# EAGLE design cominer_serial (EAGLE 9.6.2)
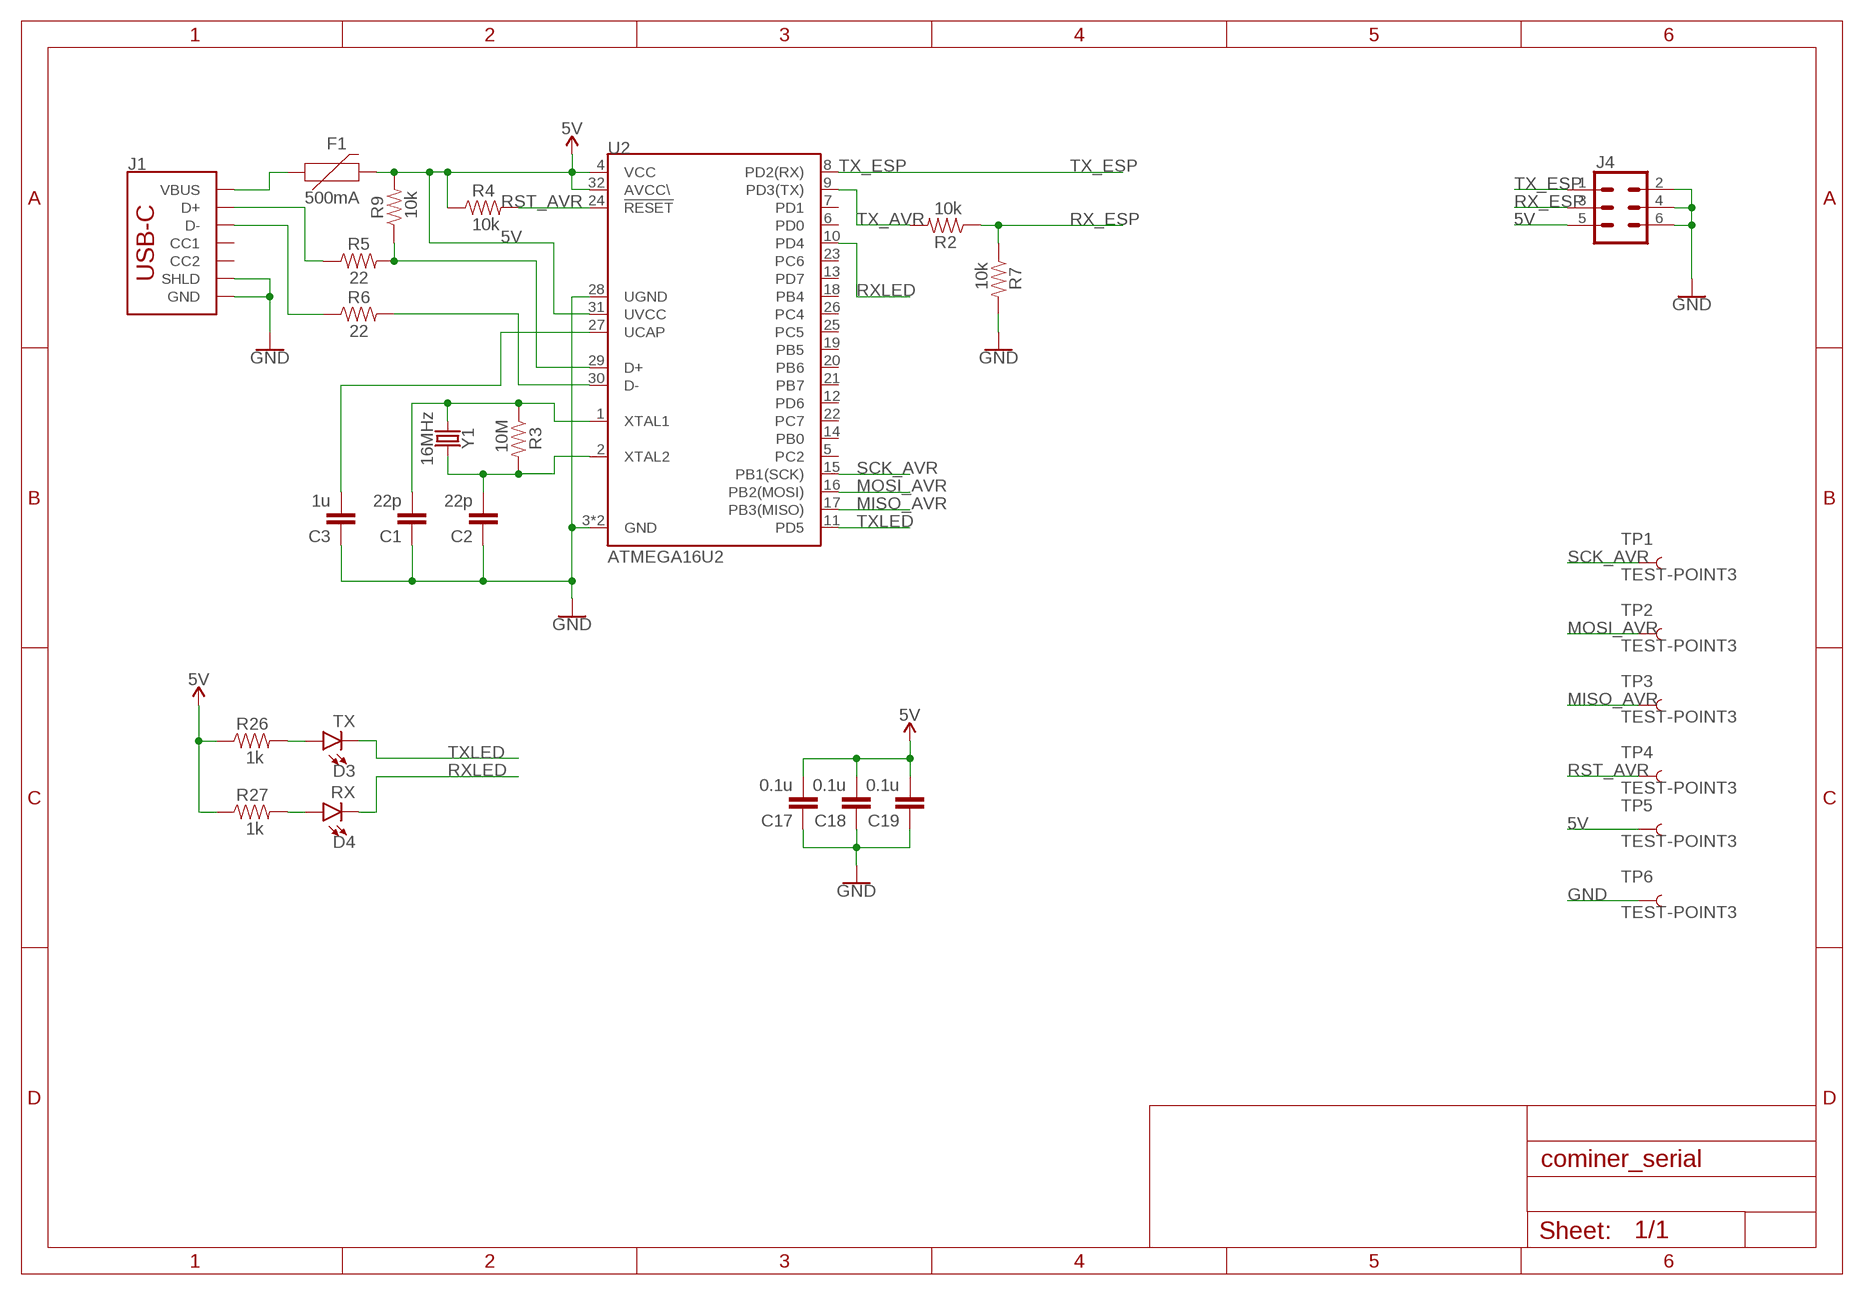
[diagram p0: schematic, sheet 1]

## Parts
C1  22p  CAP-0805  [0805]
C2  22p  CAP-0805  [0805]
C3  1u  CAP-0805  [0805]
C17  0.1u  CAP-0805  [0805]
C18  0.1u  CAP-0805  [0805]
C19  0.1u  CAP-0805  [0805]
D3  TX  LED-YELLOW0603  [LED-0603]
D4  RX  LED-YELLOW0603  [LED-0603]
F1  500mA  PPTC_16V_2.5A  [1812]
J1  USB_C  [USB-C-16P-SMD]
J4  CONN_03X2SHROUD  [2X3-SHROUDED]
R2  10k  RESISTOR0805  [0805]
R3  10M  RESISTOR0805  [0805]
R4  10k  RESISTOR0805  [0805]
R5  22  RESISTOR0805  [0805]
R6  22  RESISTOR0805  [0805]
R7  10k  RESISTOR0805  [0805]
R9  10k  RESISTOR0805  [0805]
R26  1k  RESISTOR0805  [0805]
R27  1k  RESISTOR0805  [0805]
TP1  TEST-POINT3  [PAD.03X.03]
TP2  TEST-POINT3  [PAD.03X.03]
TP3  TEST-POINT3  [PAD.03X.03]
TP4  TEST-POINT3  [PAD.03X.03]
TP5  TEST-POINT3  [PAD.03X.03]
TP6  TEST-POINT3  [PAD.03X.03]
U2  ATMEGA16U2  [QFN32]
Y1  16MHz  CRYSTAL-16MHZSMD-5X3.2  [CRYSTAL-SMD-5X3.2-4PAD]

## Nets
5V: C17.2 C18.2 C19.2 F1.2 J4.5 R4.1 R9.2 R26.1 R27.1 TP5.P$1 U2.4(VCC) U2.31(UVCC) U2.32(AVCC\)
GND: C1.1 C2.1 C3.1 C17.1 C18.1 C19.1 J1.GND J1.GND2(GND) J1.SHLD1(SHLD) J1.SHLD2(SHLD) J1.SHLD3(SHLD) J1.SHLD4(SHLD) J4.2 J4.4 J4.6 R7.2 TP6.P$1 U2.3(GND) U2.28(UGND) U2.EP(GND)
MISO_AVR: TP3.P$1 U2.17(PB3(MISO))
MOSI_AVR: TP2.P$1 U2.16(PB2(MOSI))
N$1: C1.2 R3.1 U2.1(XTAL1) Y1.1
N$2: C2.2 R3.2 U2.2(XTAL2) Y1.3
N$3: C3.2 U2.27(UCAP)
N$6: R6.2 U2.30(D-)
N$7: R5.2 R9.1 U2.29(D+)
N$8: J1.A6(D+) J1.B6(D+) R5.1
N$9: J1.A7(D-) J1.B7(D-) R6.1
N$10: F1.1 J1.VBUS1(VBUS) J1.VBUS2(VBUS)
N$32: D3.A R26.2
N$33: D4.A R27.2
RST_AVR: R4.2 TP4.P$1 U2.24(!RESET)
RX_ESP: J4.3 R2.1 R7.1
RXLED: D4.C U2.10(PD4)
SCK_AVR: TP1.P$1 U2.15(PB1(SCK))
TX_AVR: R2.2 U2.9(PD3(TX))
TX_ESP: J4.1 U2.8(PD2(RX))
TXLED: D3.C U2.11(PD5)
Unconnected: J1.A5(CC1) J1.B5(CC2) U2.5(PC2) U2.6(PD0) U2.7(PD1) U2.12(PD6) U2.13(PD7) U2.14(PB0) U2.18(PB4) U2.19(PB5) U2.20(PB6) U2.21(PB7) U2.22(PC7) U2.23(PC6) U2.25(PC5) U2.26(PC4)

## Library data of the parts
C1-C3 C17-C19 = SparkFun-Capacitors:CAP
D3 D4 = SparkFun-LED:LED-YELLOW: Yellow SMD LED Used in manufacturing several products at SparkFun. Packages: 0603 - SMD 0603 package[Product Link] <http://www.kingbrightusa.com/product.asp?catalog_name=LED&product_id=APT1608SYCK> 0603 -SMART - SMART SMD 0603 package (more efficient/more expensive) [Product Link] <http://www.osram-os.com/osram_os/en/products/product-catalog/led-light-emitting-diodes/smartled-0603/ly-l29k/index.jsp> LilyPad - SMD1206 package[Product Datasheet] <https://www.sparkfun.com/datasheets/DevTools/LilyPad/Q150YUS4.pdf> SparkFun Products: Blynk Board <https://www.sparkfun.com/products/13794> IOIO-OTG <https://www.sparkfun.com/products/13613> XBee Explorer Serial <https://www.sparkfun.com/products/13225>; PROD_ID: DIO-09003; VALUE: Yellow
F1 = SparkFun-Fuses:PPTC: Resettable Fuse PPTC Resettable Fuse. Really a sort of resistor with a polymeric positive temperature coefficient whose resistance increases dramatically with an increase in temperature. When heated by the power passing through the resistance rises causing the current to be limited, protecting the circuit. This is achieved by the transition of the polymer from a crystalline to an amorphous state where the conductive carbon separates breaking the conductive pathways found in the cool crystalline structure. When a PPTC cools back down it resumes conducting letting the circuit turn back on. SparkFun Products: SparkFun RedBoard - Programmed with Arduino <https://www.sparkfun.com/products/12757> Pro Micro - 5V/16MHz <https://www.sparkfun.com/products/12640> Arduino Pro 328 - 5V/16MHz <https://www.sparkfun.com/products/10915> MP3 Trigger <https://www.sparkfun.com/products/13720>; PROD_ID: RES-14390; VALUE: 16V/2.5A(5A TRIP)
J1 = SparkFun-Connectors:USB_C: USB Type C 16Pin Connector Super Speed pins not available on the 16-pin purely SMD connector so this part is best for USB 2.0 implementations. D1 and D2 are tied together enabling D+/- no matter which way the cable is plugged into the connector. The two channel configuration pins (CC1/2) are exposed. These are normally connected to ground via 5.1k resistors but can be reconfigured for high current/high power applications. **4-LAYER BOARD WARNING!!** If designing 4-layer board, make sure to select the variant _4-LAYER-ISOLATED. The linked footprint (USB-C-16-4LAYER-ISOLATED) includes some very necessary cutout polygons in the inner layers (2 and 15). This prevents the PTH mounting shield legs on the USB connector from electrically connecting any other polygons on the inner layers (usually VCC and GND).
J4 = SparkFun-Connectors:CONN_03X2: Multi connection point. Often used as Generic Header-pin footprint for 0.1 inch spaced/style header connections You can populate with any combo of single row headers, but if you'd like an exact match, check these: Header - 2x3 (Male, 0.1") <https://www.sparkfun.com/products/12807> (PRT-12807) Header - 2x3 (Female, 0.1") <https://www.sparkfun.com/products/13010> (PRT-13010) 2x3 Pin Shrouded Header <https://www.sparkfun.com/products/10877> (PRT-10877) On any of the 0.1 inch spaced packages, you can populate with these: Break Away Headers - Straight <https://www.sparkfun.com/products/116> (PRT-00116) Break Away Male Headers - Right Angle <https://www.sparkfun.com/products/553> (PRT-00553) Female Headers <https://www.sparkfun.com/products/115> (PRT-00115) Break Away Headers - Machine Pin <https://www.sparkfun.com/products/117> (PRT-00117) Break Away Female Headers - Swiss Machine Pin <https://www.sparkfun.com/products/743> (PRT-00743) Special note: the shrouded connector mates well with our 3x2 ribbon cables: Ribbon Crimp Connector - 6-pin (2x3, Female) <https://www.sparkfun.com/products/10651> (PRT-10651) Ribbon Cable - 6 wire (15ft) <https://www.sparkfun.com/products/10646> (PRT-10646); PROD_ID: CONN-10681; SF_ID: PRT_10877
R2-R7 R9 R26 R27 = SparkFun-Resistors:RESISTOR: Generic Resistor Package
TP1-TP6 = SparkFun-Connectors:TEST-POINT: SparkFun Test Points Bare copper test points for troubleshooting or In-Circuit-Testing. These are used by our Production team for verifying production board runs using pogo-pins on test beds. SparkFun Products: SparkFun LSM9DS1 Breakout <https://www.sparkfun.com/products/13284> SparkFun PSOC <https://www.sparkfun.com/products/13714> SparkFun Load Cell Amplifier <https://www.sparkfun.com/products/13879>
U2 = Cominer-Microcontroller:ATMEGA16U2
Y1 = SparkFun-Clocks:CRYSTAL-16MHZ: 16MHz Crystal Digikey Example <http://www.digikey.com/product-search/en?keywords=535-9122-1-ND> Frequency: 16MHz Frequency Stability: ±50ppm Frequency Tolerance: ±20ppm Load Capacitance: 18pF SparkFun Products: Pro Micro -5V/16MHz <https://www.sparkfun.com/products/12640> SparkFun Serial Enabled LCD Kit <https://www.sparkfun.com/products/10097>; PROD_ID: XTAL-08218; SF_ID: COM-00094

## Board
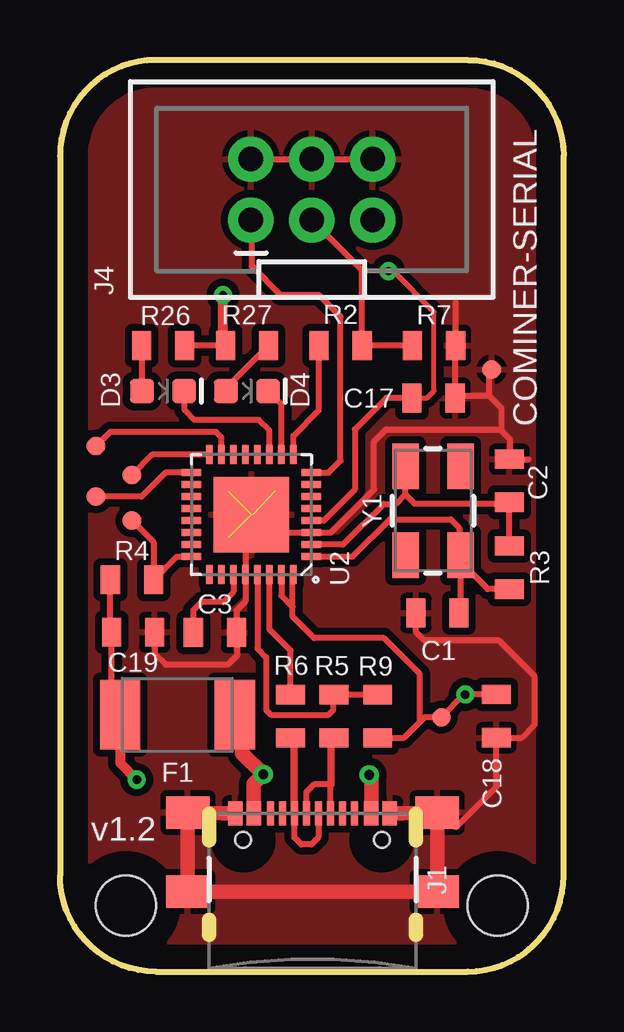
[diagram p1: board, top side]
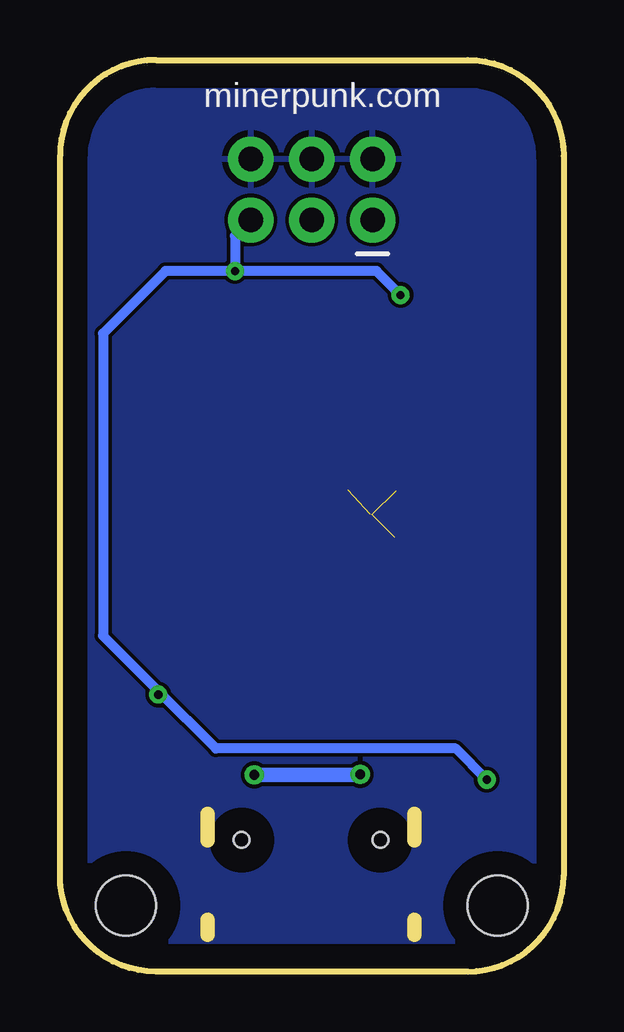
[diagram p2: board, bottom side, seen from below]

Size 21 x 38 mm. Coordinates in mm from the lower left corner, seen from the top.
Outline: 17,38 4,38 arc90 0,34 0,4 arc90 4,0 17,0 arc90 21,4 21,34 arc90 17,38
Copper layers (1*16): Top 0.035mm / dielectric 1.5mm / Bottom 0.035mm
Design rules "default": minimum track width 6mil, minimum drill 0.35mm, track to track 6mil, track to pad 6mil, pad to pad 6mil, via to via 6mil, smd to smd 6mil, copper to edge 40mil, drill to drill 6mil, minimum pad ring 10mil, minimum via ring 8mil, stop-mask expansion 4mil, vias tented up to drill 0mil, thermal gap 10mil
Holes 2.5 mm at 2.75,2.75 18.25,2.75

### Footprints (pad centres in the part's own frame; a part is rotated, then mirrored left to right if it is on the bottom)
0805 = smd 0.8 x 1.2: 1 -0.9,0; 2 0.9,0
LED-0603 = smd 1 x 1: A -0.877,0; C 0.877,0
1812 = smd 1.676 x 2.896: 1 -2.388,0; 2 2.388,0
USB-C-16P-SMD = smd 0.3 x 1: A5 -1.25,-0.34; A6 -0.25,-0.34; A7 0.25,-0.34; A8 1.25,-0.34; B5 1.75,-0.34; B6 0.75,-0.34; B7 -0.75,-0.34; B8 -1.75,-0.34 | smd 0.6 x 1: GND -3.225,-0.34; GND2 3.225,-0.34; VBUS1 -2.45,-0.34; VBUS2 2.45,-0.34 | smd 1.8 x 1.35: SHLD1 -5.2,-0.3; SHLD2 5.2,-0.3; SHLD3 -5.2,-3.6; SHLD4 5.2,-3.6 | hole 0.65: -2.89,-1.445; 2.89,-1.445
2X3-SHROUDED = drill 1.016 pad 1.88: 1 -1.27,2.54; 2 1.27,2.54; 3 -1.27,0; 4 1.27,0; 5 -1.27,-2.54; 6 1.27,-2.54
PAD.03X.03 = smd 0.762 x 0.762: P$1 0,0
QFN32 = smd 0.285 x 0.8: 1 -1.04,-2.5; 2 -0.54,-2.5; 3 -0.04,-2.5; 4 0.46,-2.5; 5 0.96,-2.5; 6 1.46,-2.5; 7 1.96,-2.5; 8 2.46,-2.5; 17 2.46,2.5; 18 1.96,2.5; 19 1.46,2.5; 20 0.96,2.5; 21 0.46,2.5; 22 -0.04,2.5; 23 -0.54,2.5; 24 -1.04,2.5 | smd 0.8 x 0.285: 9 3.21,-1.75; 10 3.21,-1.25; 11 3.21,-0.75; 12 3.21,-0.25; 13 3.21,0.25; 14 3.21,0.75; 15 3.21,1.25; 16 3.21,1.75; 25 -1.79,1.75; 26 -1.79,1.25; 27 -1.79,0.75; 28 -1.79,0.25; 29 -1.79,-0.25; 30 -1.79,-0.75; 31 -1.79,-1.25; 32 -1.79,-1.75 | smd 3.15 x 3.15: EP 0.71,0
CRYSTAL-SMD-5X3.2-4PAD = smd 1.9 x 1.1: 1 -1.85,-1.15; 2 1.85,-1.15; 3 1.85,1.15; 4 -1.85,1.15

### Placement (x,y rotation side)
C1  15.74,14.95 0 top
C2  18.74,20.46 270 top
C3  6.46,14.13 180 top
C17  15.58,23.91 180 top
C18  18.2,10.65 90 top
C19  3.05,14.15 180 top
D3  4.3,24.2 0 top
D4  7.8,24.2 0 top
F1  4.9,10.7 180 top
J1  10.53,6.93 0 top
J4  10.5,32.6 90 top
R2  11.7,26.1 180 top
R3  18.74,16.84 90 top
R4  3,16.33 0 top
R5  11.43,10.64 90 top
R6  9.62,10.64 90 top
R7  15.6,26.1 0 top
R9  13.25,10.64 270 top
R26  4.3,26.1 180 top
R27  7.8,26.1 0 top
TP1  1.5,21.9 180 top
TP2  3,20.7 180 top
TP3  1.5,19.8 180 top
TP4  3,18.8 180 top
TP5  15.9,10.6 180 top
TP6  18,25.1 180 top
U2  7.98,18.34 90 top
Y1  15.56,19.21 90 top

### Tracks (layer width: path | path; a pad name or v marks a point on that pad's centre or on a via)
5V  (via drill 0.35)
  Top 0.203: C17.2 15.31,23.91 15.6,24.2 15.6,27.5 13.9,29.2 v13.7,29.2
  Top 0.254: R9.2 14.34,9.74 15,10.4 | 15,10.4 15,12.4 13.5,13.9 10.6,13.9 9.7,14.8 9.7,15.2 | 9.7,15.2 9.7,16.52 U2.32 | U2.31 9.23,15.67 9.7,15.2 | C17.2 13.61,23.91 12.3,22.6 12.3,20.1 11,18.8 U2.4 | R27.1 R26.1 | C18.2 v16.9,11.55 16.85,11.55 TP5.P$1 15.2,10.6 15,10.4 | F1.2 2.15,11.06 C19.2 2.1,14.2 R4.1
  Top 0.406: F1.2 2.51,8.69 v3.2,8 | R27.1 6.8,26.2 v6.8,28.2
  Bottom 0.406: v3.2,8 4.5,9.3 14.5,9.3 16.9,11.7 | 16.9,11.7 v16.9,11.55 | v6.8,28.2 7.8,29.2 v13.7,29.2 | 16.9,11.7 19.2,14 19.2,26.6 16.6,29.2 v13.7,29.2 | J4.5 13.7,30.67 v13.7,29.2
GND  (3 unrouted)
  Top 0.203: 7,20.03 7,20.1 | 9,20.07 9,20.1 | 7.03,18.1 7,18.1 | U2.EP 8.05,19.05
  Top 0.254: U2.EP 7.73,18.8 U2.28 7.73,15.43 7.36,15.06 C3.1 7.4,14.09 7.4,13.2 7,12.8 4.4,12.8 3.95,13.25 C19.1 | 8.73,18.3 U2.3 11.3,18.3 13.1,20.1 13.1,22.1 13.6,22.6 18.35,22.6 18.4,22.55 | 19.55,21.35 18.75,21.35 C2.1 18.75,21.37 18.75,22.2 18.4,22.55 | C1.1 14.85,14.94 14.85,14.15 15.2,13.8 18.3,13.8 19.8,12.3 19.8,10.3 19.25,9.75 C18.1 18.2,7.7 16.52,6.02 J1.SHLD2 | 17.9,24 18.4,23.5 18.4,22.55 | 17.9,24 17.9,25 TP6.P$1 | 17.9,24 16.57,24 C17.1 16.48,26.08 R7.2 16.5,27.87 | J4.2 J4.4 J4.6
  Top 0.61: J1.GND2 14.27,6.59 J1.SHLD2 J1.SHLD4 J1.SHLD3 J1.SHLD1 6.79,6.59 J1.GND
  pour Top (isolate 0.305): 22,-1 22,39 -1,39 -1,-1
  pour Bottom: -1.9,24.04 -1.9,-1.96 23.1,-1.96 23.1,40.04 -1.9,40.04
MISO_AVR
  Top 0.254: U2.17 4.4,20.8 3.4,19.8 TP3.P$1
MOSI_AVR
  Top 0.254: U2.16 3.85,21.55 TP2.P$1
N$1
  Top 0.254: U2.1 12.2,17.3 13.75,18.85 16.3,18.85 16.65,18.5 16.65,17.42 Y1.1 | C1.2 16.71,15.02 Y1.1 | R3.1 17.84,15.94 16.71,17.07 Y1.1
N$2
  Top 0.254: U2.2 11.8,17.8 13.5,19.5 14,19.5 14.4,19.9 Y1.3 14.41,19.89 14.8,19.5 18.68,19.5 C2.2 R3.2
N$3
  Top 0.254: U2.27 7.23,15.83 6.8,15.4 5.9,15.4 5.56,15.06 C3.2
N$6
  Top 0.254: R6.2 9.62,13.38 8.73,14.27 U2.30
N$7
  Top 0.254: R9.1 R5.2 11.4,11.51 11.4,10.9 11.2,10.7 8.8,10.7 8.6,10.9 8.6,13.1 8.23,13.47 U2.29
N$8
  Top 0.254: 11.5,9.67 R5.1 | J1.B6 11.28,7.8 | 11.28,7.8 11.2,7.8 10.6,7.8 10.28,7.48 J1.A6 | 11.3,7.8 11.28,7.8
  Top 0.305: R5.1 11.3,9.6 11.3,7.8
N$9
  Top 0.254: J1.A7 10.78,5.6 10.48,5.3 10.07,5.3 9.78,5.59 J1.B7
  Top 0.305: R6.1 9.75,9.61 9.75,6.62 J1.B7
N$10  (via drill 0.4)
  Top 0.254: 8.1,6.57 J1.VBUS1
  Top 0.61: 7.29,10.3 F1.1 7.6,10.39 7.6,9.1 v8.48,8.22 8.08,7.82 J1.VBUS1 | J1.VBUS2 12.98,8.12 v12.9,8.2
  Bottom 0.61: v12.9,8.2 8.5,8.2 v8.48,8.22
N$32
  Top 0.254: R26.2 3.4,24.22 D3.A
N$33
  Top 0.254: D4.A 6.92,24.32 R27.2
RST_AVR
  Top 0.254: U2.24 4.87,17.3 R4.2 3.9,17.9 TP4.P$1
RX_ESP
  Top 0.254: R7.1 R2.1 12.6,29.23 J4.3
RXLED
  Top 0.254: U2.10 9.23,23.65 D4.C
SCK_AVR
  Top 0.254: U2.15 6.73,22.27 6.5,22.5 2.1,22.5 TP1.P$1
TX_AVR
  Top 0.254: U2.9 9.73,22.33 10.8,23.4 R2.2
TX_ESP
  Top 0.254: J4.1 8,31.29 8,29.4 9.2,28.2 10.8,28.2 11.7,27.3 11.7,21.3 11.2,20.8 U2.8
TXLED
  Top 0.254: U2.11 8.73,22.57 8.3,23 5.6,23 5.2,23.4 5.2,24.18 D3.C

### Text on the board
tPlace: COMINER-SERIAL | v1.2
bPlace: minerpunk.com
tNames: U2
200bmp: MINER PUNK